# EAGLE schematic logicShifter2 (EAGLE 8.5.1)
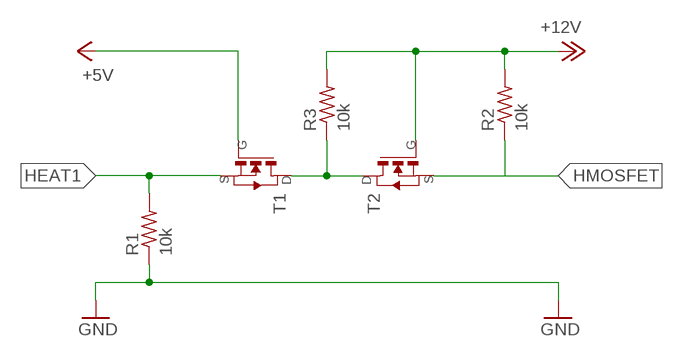
[diagram p0: schematic, sheet 1]

## Parts
R1  10k  RES-US1206FAB  [R1206FAB]
R2  10k  RES-US1206FAB  [R1206FAB]
R3  10k  RES-US1206FAB  [R1206FAB]
T1  NMOSFETSOT23  [SOT-23]
T2  NMOSFETSOT23  [SOT-23]

## Nets
+5V: T1.3(G)
+12V: R2.2 R3.2 T2.3(G)
GND: R1.1
HEAT1: R1.2 T1.2(S)
HMOSFET: T2.2(S)
N$1: R3.1 T1.1(D) T2.1(D)
N$5: R2.1

## Library data of the parts
R1-R3 = fab:RES-US: Resistor (US Symbol) Variants with postfix FAB are widened to allow the routing of internal traces
T1 T2 = fab:NMOSFET: MOS FET